# Altium project ESP-MONITOR.PrjPCB (part 2 of 2)

## Sheet PAGE5-CURRENT_MON.SchDoc
size A3; DocumentNumber: 5; SheetNumber: 5; SheetTotal: 5
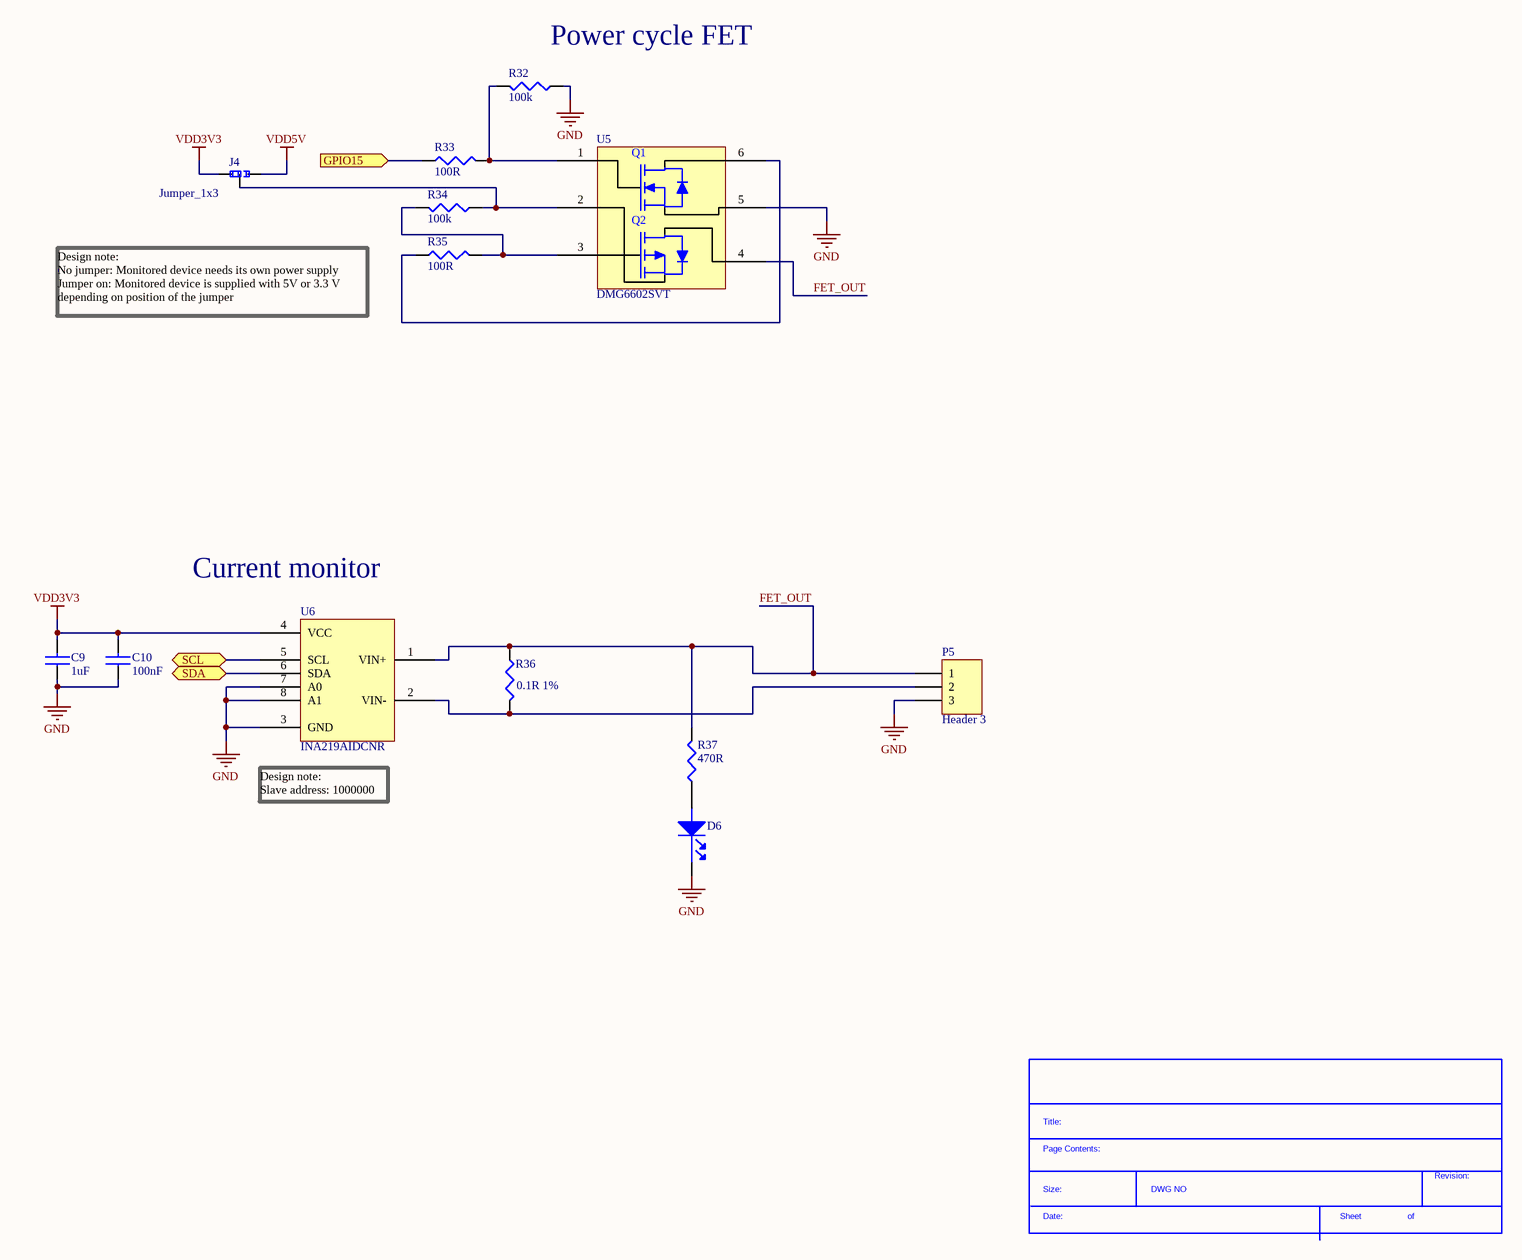
[diagram p4: PAGE5-CURRENT_MON.SchDoc]

### Parts
(Parts that share a designator on the sheet are numbered #1, #2 ... from top to bottom, then left to right.)
*?#5  SDTitleBlock  (value not drawn)  (graphical)
C9  1uF  [CAP0603]
C10  100nF  [CAP0603]
D6  LED RED  [LED0603]  (value not drawn)
J4  Jumper_1x3  [Jumper_1x3_2.54MM]  (no BOM)
P5  Header 3  [HDR1X3]  (no BOM)
R32  100k  [RES0603]
R33  100R  [RES0603]
R34  100k  [RES0603]
R35  100R  [RES0603]
R36  0.1R 1%  [RES1206]
R37  470R  [RES0603]
U5  DMG6602SVT  [TSOT26]
U6  INA219AIDCNR  [SOT23-8]

### Ports
GPIO15 (in), SCL (bidir), SDA (bidir)

### Nets
GND: C9.1 C10.1 D6.1(cathode) P5.3 R32.1 U5.5(S1) U6.3(GND) U6.7(A0) U6.8(A1)
VDD3V3: C9.2 C10.2 J4.1 U6.4(VCC)
VDD5V: J4.3
FET_OUT: P5.1 R36.1 R37.2 U5.4(D2) U6.1(VIN+)
GPIO15: R33.1 ; port GPIO15
SCL: U6.5(SCL) ; port SCL
SDA: U6.6(SDA) ; port SDA
NetD6_2: D6.2(ANODE) R37.1
NetJ4_2: J4.2 R34.1 U5.2(S2)
NetP5_2: P5.2 R36.2 U6.2(VIN-)
NetR32_2: R32.2 R33.2 U5.1(G1)
NetR34_2: R34.2 R35.2 U5.3(G2)
NetR35_1: R35.1 U5.6(D1)

### Notes on the sheet
- (near R32) Power cycle FET
- Design note:
  No jumper: Monitored device needs its own power supply Jumper on: Monitored device is supplied with 5V or 3.3 V depending on position of the jumper
- (near U6) Current monitor
- (near U6) Design note:
  Slave address: 1000000
- Title
- Size:
- Date:
- A3
- Number:
- Time:
- Revision:
- Sheet
- of
- File:
- (in symbol DMG6602SVT) Q1; Q2
- (in symbol SDTitleBlock) Title:; Page Contents:; Revision:; Size:; DWG NO; Date:; Sheet; of

### Library data of the parts
C9 = 1uF: MURATA - GRM188R61H105KAALD - CAP, MLCC, X5R, 1UF, 50V, 0603; Ceramic Capacitor Case: 0603 [1608 Metric]; Capacitance: 1; Voltage Rating: 50; Capacitance Tolerance: ± 10%; Dielectric Characteristic: X5; Product Range: GRM Series; SVHC: No SVHC (17-Dec-2015); Capacitor Terminals: SMD<!--FANDB--><div class="features-and-benefits-container"><div class="features-and-benefits-description"><span class="features-benefits-value">The Murata GRM series capacitors are Multilayer Ceramic Chip Capacitors (MLCC) used for general purpose applications. These MLCC capacitors are classified into temperature compensating and high dielectric constant types depending on the change in electrostatic capacitance due to change in temperature. The temperature compensating capacitors feature a small rate of change in electrostatic capacitance as the temperature changes and are used for applications such as filters and high frequency circuit matching. The high dielectric constant capacitors use materials with a high dielectric constant and feature a large electrostatic capacitance. Typical applications are power supply decoupling and smoothing circuits.</span></div><div class="features-and-benefits-list"><ul class="features-and-benefits-list-list"><li class="features-and-benefits-list-item">Large capacity and small size in a multilayer structure</li><li class="features-and-benefits-list-item">Capacitance value ranging from 0.1pF to 220?F</li><li class="features-and-benefits-list-item">Tin plated external electrodes, excellent solderability</li><li class="features-and-benefits-list-item">Provides good high frequency characteristics</li><li class="features-and-benefits-list-item">Excellent pulse response</li><li class="features-and-benefits-list-item">High reliability</li><li class="features-and-benefits-list-item">Capacitor size varies from 0.4×0.2mm to 5.7×5.0mm</li><li class="features-and-benefits-list-item">Rated voltage of 2.5VDC to 3.15; Supplier 1: Farnell; Manufacturer: MURATA; Manufacturer Part Number: GRM188R61H105KAALD; RoHS: YES; Stock 1: 62682; Pricing 1: 10=0.093, 100=0.062, 500=0.0507, 1000=0.0465, 2000=0.0429, 4000=0.0399, 20000=0.0372, 40000=0.0365 (GBP); Packaging: Cut Tape; Operating Temperature Min: -55; Operating Temperature Max: 85; Automotive Qualification Standard: -; MSL: -; Capacitance Tolerance ±: ± 10%; ComponentLink1URL: http://www.farnell.com/datasheets/2048611.pdf; ComponentLink1Description: http://www.farnell.com/datasheets/2048611.pdf; Supplier Part Number 1: 1845736
C10 = 100nF: MURATA - GRM188R71C104KA01J - CAP, MLCC, X7R, 0.1UF, 16V, 0603; Ceramic Capacitor Case: 0603 [1608 Metric]; Capacitance: 0.1; Voltage Rating: 16; Capacitance Tolerance: ± 10%; Dielectric Characteristic: X7; Product Range: GRM Series; SVHC: No SVHC (20-Jun-2016; Supplier 1: Farnell; Manufacturer: MURATA; Manufacturer Part Number: GRM188R71C104KA01J; RoHS: YES; Stock 1: 18297; Pricing 1: 10=0.0145, 100=0.0126, 500=0.0081, 2500=0.0059, 5000=0.0052, 10000=0.0046, 50000=0.0036, 100000=0.0035 (GBP); Packaging: Cut Tape; Operating Temperature Min: -55; Operating Temperature Max: 125; Automotive Qualification Standard: -; MSL: MSL 1 - Unlimited; ComponentLink1URL: http://www.farnell.com/datasheets/2189124.pdf; ComponentLink1Description: http://www.farnell.com/datasheets/2189124.pdf; Supplier Part Number 1: 2688519
D6 = LED RED: BROADCOM LIMITED - HSMS-C190 - LED, RED, 10MCD, 626NM; LED Mounting: SMD; Forward Current If: 20; Forward Voltage: 2.1; Wavelength Typ: 626; Luminous Intensity: 10; Viewing Angle: 170°; Lens Shape: Rectangular; SVHC: No SVHC (17-Dec-2015)<!--FANDB--><div class="features-and-benefits-container"><div class="features-and-benefits-description"><span class="features-benefits-value">The HSMS-C190 is a HER SMD Chip LED with untinted/diffused lens, made of GaP. It is designed in an industry standard package 1.6 x 0.8mm footprint with 0.8mm profile. It is compatible with IR reflow solder processes. The small size and wide viewing angle make this LED prime choices for backlighting applications and front panel illumination especially where space is a premium.</span></div><div class="features-and-benefits-list"><ul class="features-and-benefits-list-list"><li class="features-and-benefits-list-item">Small size</li><li class="features-and-benefits-list-item">Industry standard footprint</li><li class="features-and-benefits-list-item">Compatible with IR solder</li><li class="features-and-benefits-list-item">Diffused optics</li><li class="features-and-benefits-list-item">-40 to 85; Supplier 1: Farnell; Manufacturer: BROADCOM LIMITED; Manufacturer Part Number: HSMS-C190; RoHS: YES; Stock 1: 7534; Pricing 1: 1=0.361, 10=0.256, 50=0.235, 100=0.106, 200=0.101 (GBP); LED Colour: Red; Bulb Size: -; Packaging: Cut Tape; Product Range: -; Automotive Qualification Standard: -; MSL: -; ComponentLink1URL: http://www.farnell.com/datasheets/313031.pdf; ComponentLink1Description: http://www.farnell.com/datasheets/313031.pdf; ComponentLink2URL: http://www.farnell.com/datasheets/1681524.pdf; ComponentLink2Description: http://www.farnell.com/datasheets/1681524.pdf; ComponentLink3URL: http://www.farnell.com/datasheets/2165483.pdf; ComponentLink3Description: http://www.farnell.com/datasheets/2165483.pdf; Supplier Part Number 1: 2497356
P5 = Header 3: Header, 3-Pin; LatestRevisionDate: 17-Jul-2002; LatestRevisionNote: Re-released for DXP Platform.; Publisher: Altium Limited
R32 R34 = 100k: MULTICOMP - MCMR06X104 JTL - RES, CERAMIC, 100K, 5%, 0.1W, 0603; Resistance: 100; Voltage Rating: 75; Resistor Case Style: 0603 [1608 Metric]; Product Range: MCMR Series; Temperature Coefficient: ± 100; Resistor Mounting: Surface Mount Device<!--FANDB--><div class="features-and-benefits-container"><div class="features-and-benefits-description"><span class="features-benefits-value">The Multicomp MCMR series resistors are automotive grade, anti sulphured thick film chip resistor. The resistance range includes E24 and E96 decade values from 1ohm to 10Mohm. These resistors are constructed on top of a high grade ceramic body.</span></div><div class="features-and-benefits-list"><ul class="features-and-benefits-list-list"><li class="features-and-benefits-list-item">EIA 0402, 0603, 0805, 1206 chip sizes available</li><li class="features-and-benefits-list-item">High reliability and stability</li><li class="features-and-benefits-list-item">Automotive grade AEC-Q200 compliant</li><li class="features-and-benefits-list-item">Complaint with (IEC 60068-1) 55/155/56 climatic category</li><li class="features-and-benefits-list-item">Maximum operation voltage of 50V, 75V, 150V and 200V</li><li class="features-and-benefits-list-item">Power rating of 62.5mW, 100mW, 125mW and 250mW</li><li class="features-and-benefits-list-item">Available in ±1% and ±5% tolerance</li><li class="features-and-benefits-list-item">Temperature coefficient (TCR) of +200ppm/°C, +100ppm/°C and -200ppm/°C to +400ppm/°C</li><li class="features-and-benefits-list-item">Operating temperature range -55°C to 155; Supplier 1: Farnell; Manufacturer: MULTICOMP; Manufacturer Part Number: MCMR06X104 JTL; RoHS: Y-EX; Stock 1: 187; Pricing 1: 10=0.0109, 100=0.0085, 500=0.006, 1000=0.0048, 2500=0.004, 5000=0.003, 25000=0.002, 50000=0.0016 (GBP); Power Rating: 100; Resistance Tolerance: ± 5%; Packaging: Cut Tape; Resistor Element Material: Ceramic; Automotive Qualification Standard: -; ComponentLink1URL: http://www.farnell.com/datasheets/1716707.pdf; ComponentLink1Description: http://www.farnell.com/datasheets/1716707.pdf; Supplier Part Number 1: 2073357
R33 R35 = 100R: MULTICOMP - MC0063W06031100R - RES, THICK FILM, 100R, 1%, 0.063W, 0603; Resistance: 100; Voltage Rating: 50; Resistor Case Style: 0603 [1608 Metric]; Power Rating: 63; Product Range: MC Series; Temperature Coefficient: ± 200; SVHC: No SVHC (12-Jan-2017); External Depth: 0.45; External Length / Height: 1.6; External Width: 0.8; No. of Pins: 2; Reel Quantity: 5000; Resistor Mounting: Surface Mount Device; Temperature Coeff. +: 200; Voltage Rating V DC: 50V<!--FANDB--><div class="features-and-benefits-container"><div class="features-and-benefits-description"><span class="features-benefits-value">The Multicomp MC series current sense resistors are thick film chip resistors. The resistance range includes E96 and E24 decade values from 1ohm to 10Mohm.</span></div><div class="features-and-benefits-list"><ul class="features-and-benefits-list-list"><li class="features-and-benefits-list-item">EIA 0402, 0603, 0805, 1206 chip sizes available</li><li class="features-and-benefits-list-item">Small size and low weight</li><li class="features-and-benefits-list-item">Suitable for both wave and reflow soldering</li><li class="features-and-benefits-list-item">Reduction of assembly costs</li><li class="features-and-benefits-list-item">Maximum working voltage of 50V(0402, 0603), 150V(0805), 200V(1206)</li><li class="features-and-benefits-list-item">Available in ±1%, ±2% and ±5% tolerance</li><li class="features-and-benefits-list-item">Power rating of 62.5mW, 100mW and 125mW</li><li class="features-and-benefits-list-item">±400ppm/°C(1ohm to 10ohm), ±200ppm/°C(11ohm to 100ohm), ±100; Supplier 1: Farnell; Manufacturer: MULTICOMP; Manufacturer Part Number: MC0063W06031100R; RoHS: Y-EX; Stock 1: 78152; Pricing 1: 10=0.0011, 100=0.001, 500=0.0009, 1000=0.0008, 2500=0.0007 (GBP); Resistance Tolerance: ± 1%; Packaging: Cut Tape; Resistor Element Material: Thick Film; Automotive Qualification Standard: -; Operating Temperature Max: 155; Operating Temperature Min: -55; Operating Temperature Range: -55°C to +155; Tape Width: 8; Temperature Coeff. -: 200; Tolerance +: 1%; Tolerance -: 1%; ComponentLink1URL: http://www.farnell.com/datasheets/1788326.pdf; ComponentLink1Description: http://www.farnell.com/datasheets/1788326.pdf; ComponentLink2URL: http://www.farnell.com/cad/1561149.zip; ComponentLink2Description: http://www.farnell.com/cad/1561149.zip; ComponentLink3URL: http://www.farnell.com/datasheets/2289252.pdf; ComponentLink3Description: http://www.farnell.com/datasheets/2289252.pdf; Supplier Part Number 1: 9330364
R36 = 0.1R 1% 1206: TE CONNECTIVITY - TL2BR10FTE - RESISTOR, METAL , R10, 0.25W, 1%, 1206; Resistance: 0.1; Power Rating: 250; Resistor Case Style: 1206 [3216 Metric]; Product Range: TL Series; Resistor Element Material: Metal Foil; Temperature Coefficient: ± 75; Automotive Qualification Standard: -<!--FANDB--><div class="features-and-benefits-container"></div>; Supplier 1: Farnell; Manufacturer: TE CONNECTIVITY; Manufacturer Part Number: TL2BR10FTE; RoHS: YES; Stock 1: 1781; Pricing 1: 10=1.07, 100=0.698, 500=0.531, 1000=0.509, 2000=0.487, 4000=0.465, 20000=0.456, 40000=0.446 (GBP); Resistance Tolerance: ± 1%; Packaging: Cut Tape; ComponentLink1URL: http://www.farnell.com/datasheets/580081.pdf; ComponentLink1Description: http://www.farnell.com/datasheets/580081.pdf; Supplier Part Number 1: 2330389
R37 = 470R: MULTICOMP - MCMR06X471 JTL - RES, CERAMIC, 470R, 5%, 0.1W, 0603; Supplier 1: Farnell; Manufacturer: MULTICOMP; Manufacturer Part Number: MCMR06X471 JTL; RoHS: Y-EX; Stock 1: 3786; Pricing 1: 10=0.0089, 100=0.0076, 500=0.0063, 1000=0.0049, 2500=0.0033, 5000=0.0024, 25000=0.0016, 50000=0.0013 (GBP); ComponentLink1URL: http://www.farnell.com/datasheets/1716707.pdf; ComponentLink1Description: http://www.farnell.com/datasheets/1716707.pdf; Supplier Part Number 1: 2073513
U5 = DMG6602SVT: DIODES INC. - DMG6602SVT - MOSFET, NP CH, , 30V, 3.4, ATSOT23; Transistor Polarity: N and P Channel; Continuous Drain Current Id: 3.4; Drain Source Voltage Vds: 30; On Resistance Rds(on): 0.038; Rds(on) Test Voltage Vgs: 10; Threshold Voltage Vgs: 1; Power Dissipation Pd: 1.12; Transistor Case Style: TSOT-26; No. of Pins: 6; SVHC: No SVHC (17-Dec-2015); Continuous Drain Current Id, P Channel: -2.8; Drain Source Voltage Vds, P Channel: -30; Module Configuration: Dual; On Resistance Rds(on), P Channel: 0.073; Supplier 1: Farnell; Manufacturer: DIODES INC.; Manufacturer Part Number: DMG6602SVT; RoHS: YES; Stock 1: 4881; Pricing 1: 1=0.363, 25=0.339, 100=0.169, 250=0.166, 500=0.108, 1000=0.0809, 2000=0.0793, 6000=0.0777 (GBP); Operating Temperature Max: 150; Product Range: -; Automotive Qualification Standard: -; MSL: -; Continuous Drain Current Id, N Channel: 3.4; Drain Source Voltage Vds, N Channel: 30; On Resistance Rds(on), N Channel: 0.038; Operating Temperature Min: -55; Operating Temperature Range: -55°C to +150°C<!--FANDB--><div class="features-and-benefits-container"><div class="features-and-benefits-description"><span class="features-benefits-value">The DMG6602SVT from Diode Inc is a surface mount complementary pair enhancement mode MOSFET in TSOT-26 package. This MOSFET features low input capacitance, fast switching speed and low input/output leakage, designed to minimize the onstate resistance and maintain superior switching performance, making it ideal for high efficiency power management applications and backlighting.</span></div><div class="features-and-benefits-list"><ul class="features-and-benefits-list-list"><li class="features-and-benefits-list-item">Automotive grade AEC-Q101 qualified</li><li class="features-and-benefits-list-item">UL recognized</li><li class="features-and-benefits-list-item">Drain to source voltage (Vds) of 30V</li><li class="features-and-benefits-list-item">Gate to source voltage (Vgs) of ±20V</li><li class="features-and-benefits-list-item">Continuous drain current of 3.4A</li><li class="features-and-benefits-list-item">Power dissipation (Pd) of 1.27W</li><li class="features-and-benefits-list-item">Operating temperature range -55°C to 150°C</li><li class="features-and-benefits-list-item">Low on state resistance of 38mohm at Vgs of 10; ComponentLink1URL: http://www.farnell.com/datasheets/1915929.pdf; ComponentLink1Description: http://www.farnell.com/datasheets/1915929.pdf; Supplier Part Number 1: 2061522
U6 = INA219AIDCNR: 26V, Bi-Directional, High-Side, I2C Out Current/Power Monitor 8-SOT-23 -40 to 125; Manufacturer: Texas Instruments; Common Mode Rejection Ratio: 100dB; Max Supply Voltage: 5.5V; Min Supply Voltage: 3V; Output Current: 10mA; Accuracy: 1%; Quiescent Current: 700uA; Operating Supply Current: 1mA; Number of Amplifiers: 1; Input Offset Voltage (Vos): 100uV; Bandwidth: 3.4MHz; Min Input Voltage: 0uV; Max Supply Current: 5mA; Output Type: Digital; Supplier 1: Farnell; Manufacturer Part Number: INA219AIDCNR; Stock 1: 13730; Pricing 1: 1 = 1,75000, 25 = 1,54000, 50 = 1,39000, 100 = 1,23000, 250 = 1,16000, 500 = 1,08000, 1000 = 0,89900, 2500 = 0,80300 (EUR); Case/Package: SOT-23-8; Number of Pins: 8; Weight: 0.001411oz; Contact Plating: Gold; Min Operating Temperature: -40°C; Max Operating Temperature: 125°C; Package Quantity: 3000; Packaging: Tape and Reel; Nominal Supply Current: 700uA; Output Current per Channel: 10mA; Max Input Voltage: 26V; Features: I²C; Length: 3mm; Height: 1.3mm; Width: 1.75mm; Radiation Hardening: No; Lead Free: Lead Free; REACH SVHC: No SVHC; ComponentLink1URL: http://www.ti.com/lit/ds/symlink/ina219.pdf?src-supplier=Farnell; ComponentLink1Description: http://www.ti.com/lit/ds/symlink/ina219.pdf?src-supplier=Farnell; ComponentLink2URL: http://www.ti.com/lit/ds/symlink/ina219.pdf?src-supplier=Digi-Key; ComponentLink2Description: http://www.ti.com/lit/ds/symlink/ina219.pdf?src-supplier=Digi-Key; ComponentLink3URL: http://www.farnell.com/datasheets/1725057.pdf?src-supplier=Element14; ComponentLink3Description: http://www.farnell.com/datasheets/1725057.pdf?src-supplier=Element14; ComponentLink4URL: http://www.ti.com/general/docs/lit/getliterature.tsp?genericPartNumber=INA219&&fileType=pdf&src-supplier=Element14; ComponentLink4Description: http://www.ti.com/general/docs/lit/getliterature.tsp?genericPartNumber=INA219&&fileType=pdf&src-supplier=Element14; ComponentLink5URL: http://www.ti.com/general/docs/lit/getliterature.tsp?genericPartNumber=INA219&&fileType=pdf&src-supplier=Avnet; ComponentLink5Description: http://www.ti.com/general/docs/lit/getliterature.tsp?genericPartNumber=INA219&&fileType=pdf&src-supplier=Avnet; ComponentLink6URL: https://www.verical.com/server-webapp/html/getDatasheet?partID=327029&src-supplier=Verical; ComponentLink6Description: https://www.verical.com/server-webapp/html/getDatasheet?partID=327029&src-supplier=Verical; ComponentLink7URL: https://octopart.com/click/track?ak=2673a2b2&ct=datasheets&sig=0ce0873&at=physicalpart&sid=370&ppid=8600986&hlid=24884001&src-supplier=TI+store; ComponentLink7Description: https://octopart.com/click/track?ak=2673a2b2&ct=datasheets&sig=0ce0873&at=physicalpart&sid=370&ppid=8600986&hlid=24884001&src-supplier=TI+store; ComponentLink8URL: http://datasheet.octopart.com/INA219AIDCNR-Texas-Instruments-datasheet-10258484.pdf?src-supplier=TI+store; ComponentLink8Description: http://datasheet.octopart.com/INA219AIDCNR-Texas-Instruments-datasheet-10258484.pdf?src-supplier=TI+store; ComponentLink9URL: http://datasheet.octopart.com/INA219AIDCNR-Texas-Instruments-datasheet-10383171.pdf?src-supplier=TI+store; ComponentLink9Description: http://datasheet.octopart.com/INA219AIDCNR-Texas-Instruments-datasheet-10383171.pdf?src-supplier=TI+store; ComponentLink10URL: http://sigma.octopart.com/49252122/technical_drawing/Texas-Instruments-INA219AIDCNR.pdf?src-supplier=TI+store; ComponentLink10Description: http://sigma.octopart.com/49252122/technical_drawing/Texas-Instruments-INA219AIDCNR.pdf?src-supplier=TI+store; ComponentLink11URL: http://datasheet.octopart.com/INA219AIDCNR-Texas-Instruments-datasheet-11538655.pdf?src-supplier=Future+Electronics; ComponentLink11Description: http://datasheet.octopart.com/INA219AIDCNR-Texas-Instruments-datasheet-11538655.pdf?src-supplier=Future+Electronics; ComponentLink12URL: http://datasheet.octopart.com/INA219AIDCNR-Texas-Instruments-datasheet-102489495.pdf?src-supplier=Farnell; ComponentLink12Description: http://datasheet.octopart.com/INA219AIDCNR-Texas-Instruments-datasheet-102489495.pdf?src-supplier=Farnell; ComponentLink13URL: http://datasheet.octopart.com/INA219AIDCNR-Texas-Instruments-datasheet-24897021.pdf?src-supplier=Element14; ComponentLink13Description: http://datasheet.octopart.com/INA219AIDCNR-Texas-Instruments-datasheet-24897021.pdf?src-supplier=Element14; ComponentLink14URL: http://datasheet.octopart.com/INA219AIDCNR-Texas-Instruments-datasheet-14155040.pdf?src-supplier=IIIC; ComponentLink14Description: http://datasheet.octopart.com/INA219AIDCNR-Texas-Instruments-datasheet-14155040.pdf?src-supplier=IIIC; ComponentLink15URL: http://datasheet.octopart.com/INA219AIDCNR.-Texas-Instruments-datasheet-62277359.pdf?src-supplier=Element14; ComponentLink15Description: http://datasheet.octopart.com/INA219AIDCNR.-Texas-Instruments-datasheet-62277359.pdf?src-supplier=Element14; Supplier Part Number 1: 2295989

## Nets that join several sheets
GND: PAGE2-ESP12_CORE (15 pins), PAGE3-USB_TO_UART (7 pins), PAGE4-POWER (6 pins), PAGE5-CURRENT_MON (9 pins)
VDD3V3: PAGE2-ESP12_CORE (13 pins), PAGE3-USB_TO_UART (R31.1), PAGE4-POWER (R25.2), PAGE5-CURRENT_MON (C9.2 C10.2 J4.1 U6.4)
VDD5V: PAGE4-POWER (C4.2 F3.2 R26.2 U3.3), PAGE5-CURRENT_MON (J4.3)
VDDUSB: PAGE3-USB_TO_UART (5 pins), PAGE4-POWER (D4.2 P3.1 P4.1)
GPIO15: PAGE2-ESP12_CORE (R14.2 U1.16), PAGE5-CURRENT_MON (R33.1)
NetR10_2: PAGE2-ESP12_CORE (R10.2 VT2.2), PAGE3-USB_TO_UART (U4.28)
NetR15_2: PAGE2-ESP12_CORE (R15.2 VT1.2), PAGE3-USB_TO_UART (U4.24)
RXD0: PAGE2-ESP12_CORE (R6.1 R8.2 U1.21), PAGE3-USB_TO_UART (U4.26)
SCL: PAGE2-ESP12_CORE (5 pins), PAGE5-CURRENT_MON (U6.5)
SDA: PAGE2-ESP12_CORE (5 pins), PAGE5-CURRENT_MON (U6.6)
TXD0: PAGE2-ESP12_CORE (R5.1 U1.22), PAGE3-USB_TO_UART (U4.25)